# Altium schematic sheet LAN8870_PINOUT.SchDoc
size C; SheetNumber: 3; SheetTotal: 12
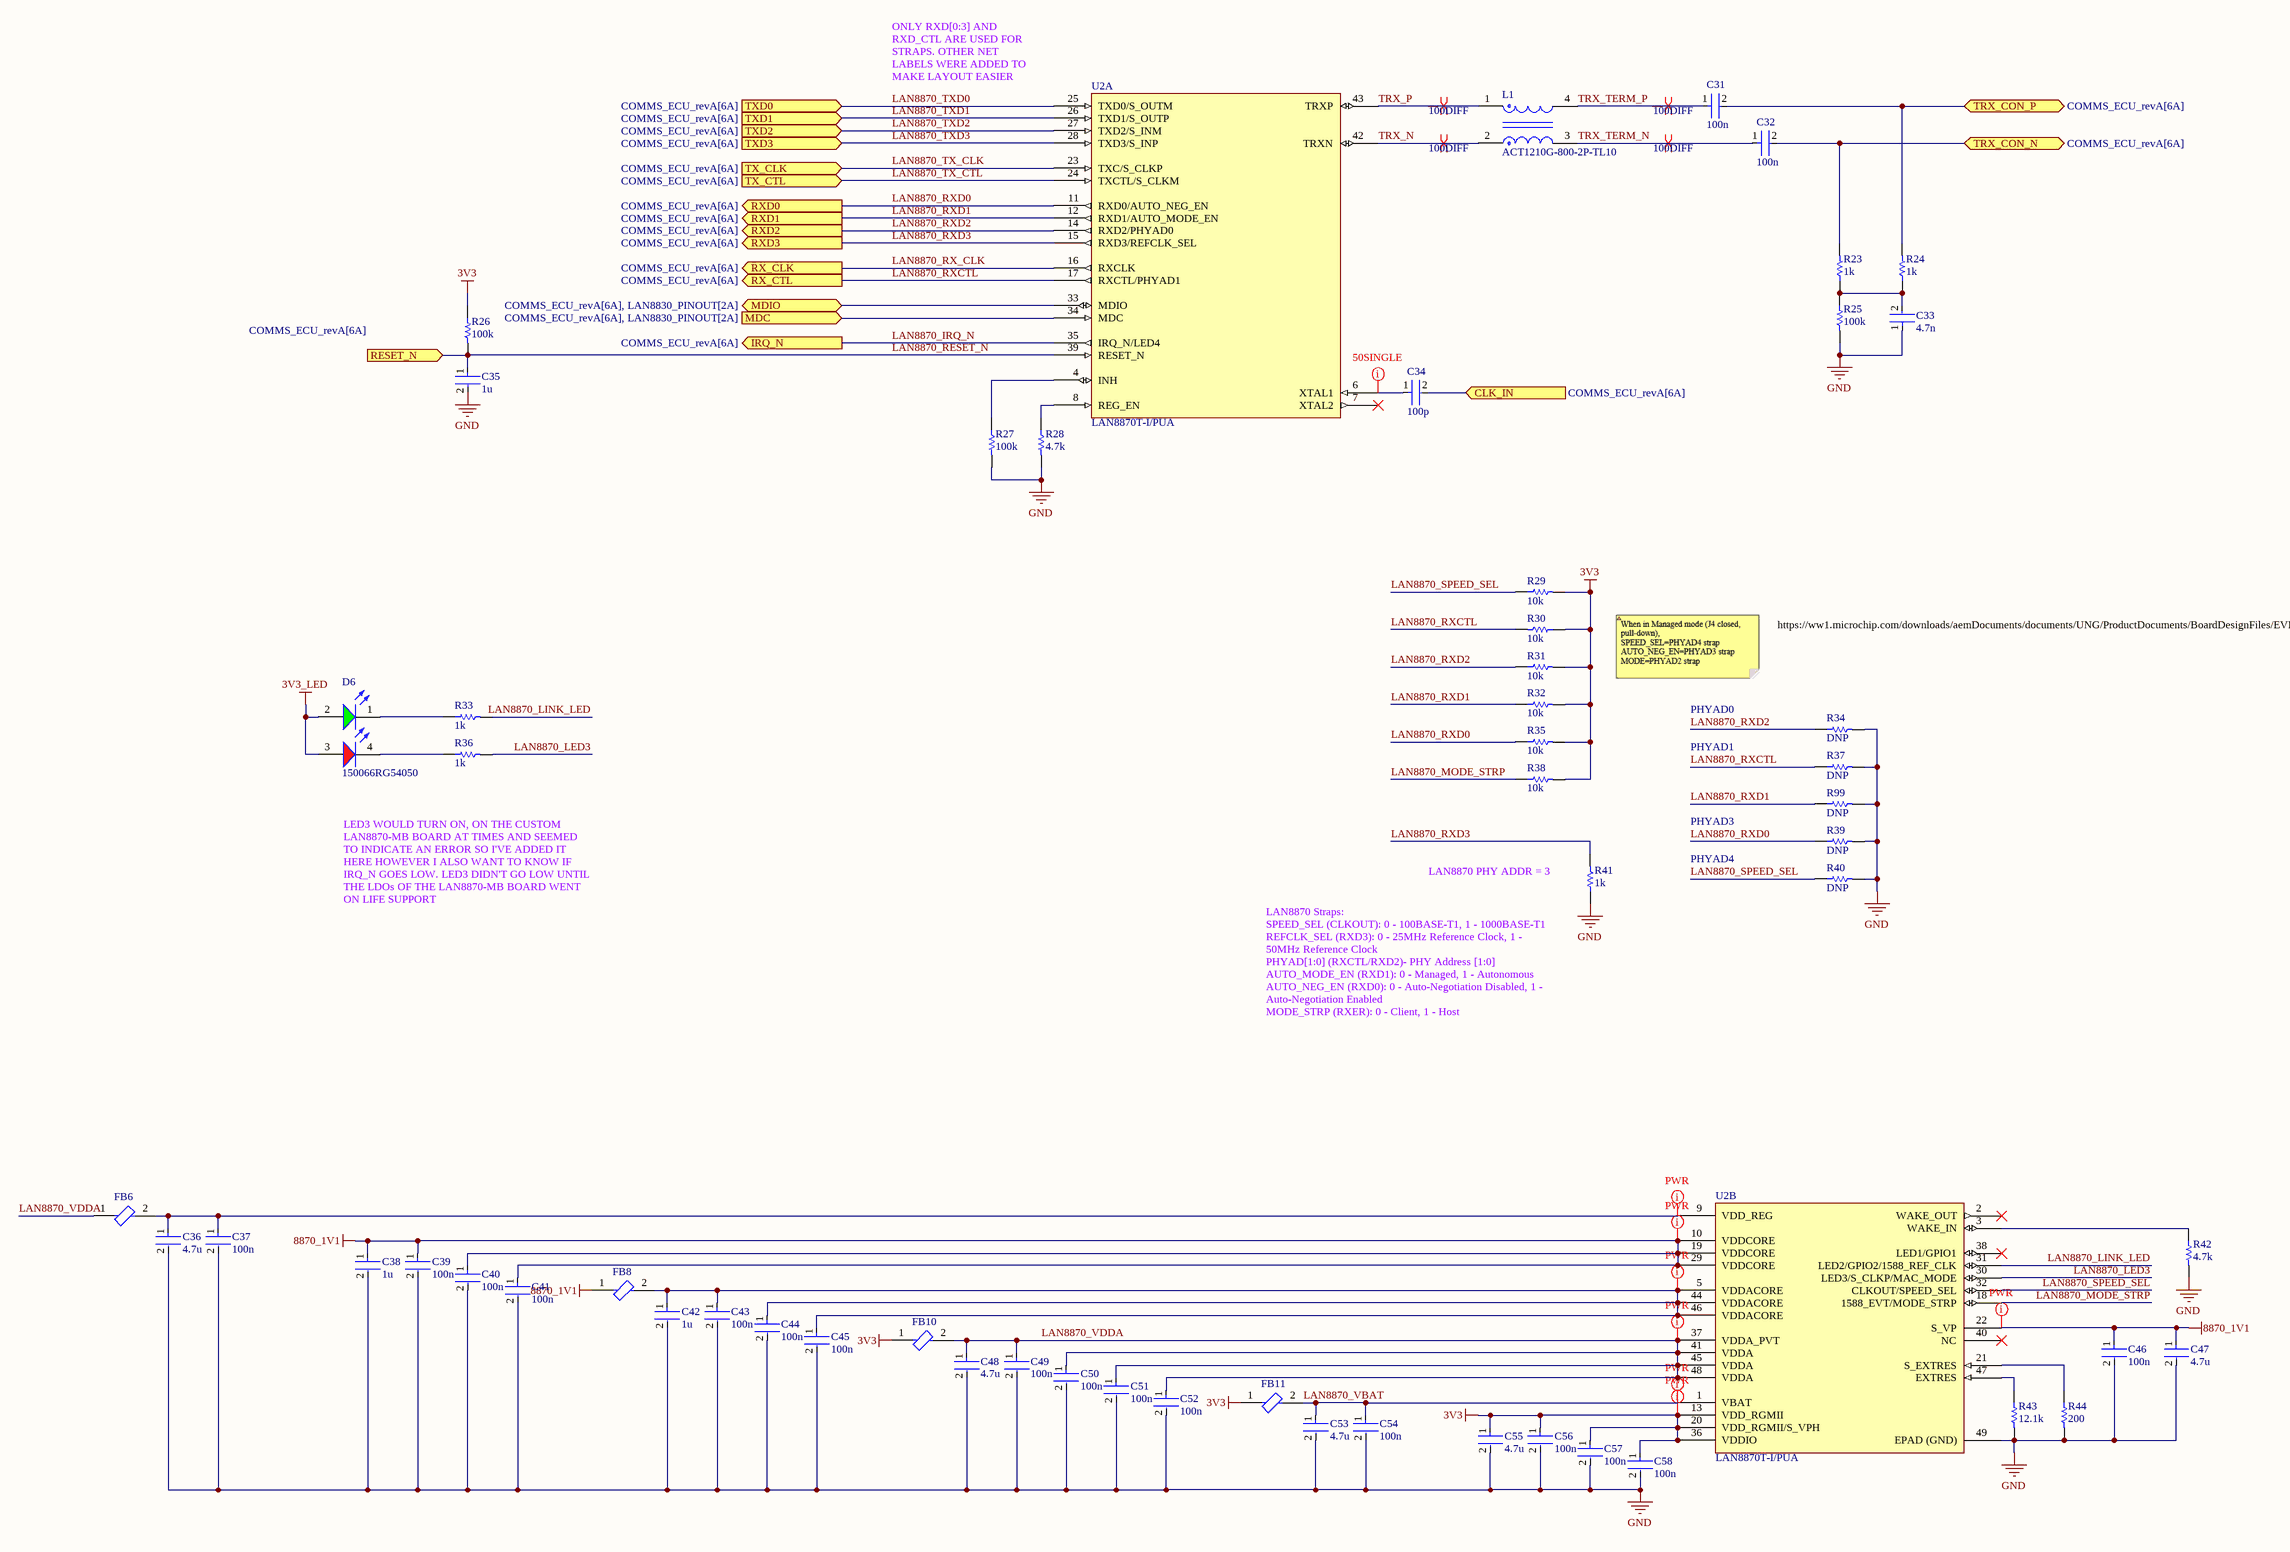
[diagram p0: LAN8870_PINOUT.SchDoc]

## Parts
C31  100n  [FP-0402-L_1_0_0_05-W_0_5-IPC_A]
C32  100n  [FP-0402-L_1_0_0_05-W_0_5-IPC_A]
C33  4.7n  [FP-0402-L_1_0_0_05-W_0_5-IPC_A]
C34  100p  [FP-0402-L_1_0_0_05-W_0_5-IPC_A]
C35  1u  [FP-0402-L_1_0_0_05-W_0_5-IPC_A]
C36  4.7u  [FP-0402-L_1_0_0_05-W_0_5-IPC_A]
C37  100n  [FP-0402-L_1_0_0_05-W_0_5-IPC_A]
C38  1u  [FP-0402-L_1_0_0_05-W_0_5-IPC_A]
C39  100n  [FP-0402-L_1_0_0_05-W_0_5-IPC_A]
C40  100n  [FP-0402-L_1_0_0_05-W_0_5-IPC_A]
C41  100n  [FP-0402-L_1_0_0_05-W_0_5-IPC_A]
C42  1u  [FP-0402-L_1_0_0_05-W_0_5-IPC_A]
C43  100n  [FP-0402-L_1_0_0_05-W_0_5-IPC_A]
C44  100n  [FP-0402-L_1_0_0_05-W_0_5-IPC_A]
C45  100n  [FP-0402-L_1_0_0_05-W_0_5-IPC_A]
C46  100n  [FP-0402-L_1_0_0_05-W_0_5-IPC_A]
C47  4.7u  [FP-0402-L_1_0_0_05-W_0_5-IPC_A]
C48  4.7u  [FP-0402-L_1_0_0_05-W_0_5-IPC_A]
C49  100n  [FP-0402-L_1_0_0_05-W_0_5-IPC_A]
C50  100n  [FP-0402-L_1_0_0_05-W_0_5-IPC_A]
C51  100n  [FP-0402-L_1_0_0_05-W_0_5-IPC_A]
C52  100n  [FP-0402-L_1_0_0_05-W_0_5-IPC_A]
C53  4.7u  [FP-0402-L_1_0_0_05-W_0_5-IPC_A]
C54  100n  [FP-0402-L_1_0_0_05-W_0_5-IPC_A]
C55  4.7u  [FP-0402-L_1_0_0_05-W_0_5-IPC_A]
C56  100n  [FP-0402-L_1_0_0_05-W_0_5-IPC_A]
C57  100n  [FP-0402-L_1_0_0_05-W_0_5-IPC_A]
C58  100n  [FP-0402-L_1_0_0_05-W_0_5-IPC_A]
D6  150066RG54050  [WL-SBCD_0606]
FB6  BLM18KG331SH1D  [FP-BLM18-0_15-t0_8-IPC_B]  (value not drawn)
FB8  BLM18KG331SH1D  [FP-BLM18-0_15-t0_8-IPC_B]  (value not drawn)
FB10  BLM18KG331SH1D  [FP-BLM18-0_15-t0_8-IPC_B]  (value not drawn)
FB11  BLM18KG331SH1D  [FP-BLM18-0_15-t0_8-IPC_B]  (value not drawn)
L1  ACT1210G-800-2P-TL10  [FP-ACT1210G-800-2P-TL10-MFG]
R23  1k  [R0603B]
R24  1k  [R0603B]
R25  100k  [R0603B]
R26  100k  [R0603B]
R27  100k  [R0603B]
R28  4.7k  [R0603B]
R29  10k  [R0603B]
R30  10k  [R0603B]
R31  10k  [R0603B]
R32  10k  [R0603B]
R33  1k  [R0603B]
R34  DNP  [R0603B]
R35  10k  [R0603B]
R36  1k  [R0603B]
R37  DNP  [R0603B]
R38  10k  [R0603B]
R39  DNP  [R0603B]
R40  DNP  [R0603B]
R41  1k  [R0603B]
R42  4.7k  [R0603B]
R43  12.1k  [R0603B]
R44  200  [R0603B]
R99  DNP  [R0603B]
U2  LAN8870T-I/PUA  [QFN50P700X700X100_HS-49N]  (parts A,B of 2)

## Ports
CLK_IN (in, see COMMS_ECU_revA[6A]), IRQ_N (out, see COMMS_ECU_revA[6A]), MDC (in, see COMMS_ECU_revA[6A], LAN8830_PINOUT[2A]), MDIO (bidir, see COMMS_ECU_revA[6A], LAN8830_PINOUT[2A]), RESET_N (in, see COMMS_ECU_revA[6A]), RX_CLK (out, see COMMS_ECU_revA[6A]), RX_CTL (out, see COMMS_ECU_revA[6A]), RXD0 (out, see COMMS_ECU_revA[6A]), RXD1 (out, see COMMS_ECU_revA[6A]), RXD2 (out, see COMMS_ECU_revA[6A]), RXD3 (out, see COMMS_ECU_revA[6A]), TRX_CON_N (bidir, see COMMS_ECU_revA[6A]), TRX_CON_P (bidir, see COMMS_ECU_revA[6A]), TX_CLK (in, see COMMS_ECU_revA[6A]), TX_CTL (in, see COMMS_ECU_revA[6A]), TXD0 (in, see COMMS_ECU_revA[6A]), TXD1 (in, see COMMS_ECU_revA[6A]), TXD2 (in, see COMMS_ECU_revA[6A]), TXD3 (in, see COMMS_ECU_revA[6A])

## Nets
3V3: C55.1 C56.1 C57.1 C58.1 FB10.1 FB11.1 R26.1 R29.2 R30.1 R31.2 R32.2 R35.2 R38.2 U2.13(VDD_RGMII) U2.20(VDD_RGMII/S_VPH) U2.36(VDDIO)
3V3_LED: D6.2(A) D6.3(A)
8870_1V1: C38.1 C39.1 C40.1 C41.1 C46.1 C47.1 FB8.1 U2.10(VDDCORE) U2.19(VDDCORE) U2.22(S_VP) U2.29(VDDCORE)
GND: C33.1 C35.2 C36.2 C37.2 C38.2 C39.2 C40.2 C41.2 C42.2 C43.2 C44.2 C45.2 C46.2 C47.2 C48.2 C49.2 C50.2 C51.2 C52.2 C53.2 C54.2 C55.2 C56.2 C57.2 C58.2 R25.2 R27.2 R28.2 R34.2 R37.2 R39.2 R40.2 R41.1 R42.2 R43.2 R44.2 R99.2 U2.49(EPAD_(GND))
CLK_IN: C34.2 ; port CLK_IN
LAN8870_IRQ_N: U2.35(IRQ_N/LED4) ; port IRQ_N
LAN8870_LED3: R36.2 U2.30(LED3/S_CLKP/MAC_MODE)
LAN8870_LINK_LED: R33.2 U2.31(LED2/GPIO2/1588_REF_CLK)
LAN8870_MODE_STRP: R38.1 U2.18(1588_EVT/MODE_STRP)
LAN8870_RESET_N: C35.1 R26.2 U2.39(RESET_N) ; port RESET_N
LAN8870_RX_CLK: U2.16(RXCLK) ; port RX_CLK
LAN8870_RXCTL: R30.2 R37.1 U2.17(RXCTL/PHYAD1) ; port RX_CTL
LAN8870_RXD0: R35.1 R39.1 U2.11(RXD0/AUTO_NEG_EN) ; port RXD0
LAN8870_RXD1: R32.1 R99.1 U2.12(RXD1/AUTO_MODE_EN) ; port RXD1
LAN8870_RXD2: R31.1 R34.1 U2.14(RXD2/PHYAD0) ; port RXD2
LAN8870_RXD3: R41.2 U2.15(RXD3/REFCLK_SEL) ; port RXD3
LAN8870_SPEED_SEL: R29.1 R40.1 U2.32(CLKOUT/SPEED_SEL)
LAN8870_TX_CLK: U2.23(TXC/S_CLKP) ; port TX_CLK
LAN8870_TX_CTL: U2.24(TXCTL/S_CLKM) ; port TX_CTL
LAN8870_TXD0: U2.25(TXD0/S_OUTM) ; port TXD0
LAN8870_TXD1: U2.26(TXD1/S_OUTP) ; port TXD1
LAN8870_TXD2: U2.27(TXD2/S_INM) ; port TXD2
LAN8870_TXD3: U2.28(TXD3/S_INP) ; port TXD3
LAN8870_VBAT: C53.1 C54.1 FB11.2 U2.1(VBAT)
LAN8870_VDDA: C48.1 C49.1 C50.1 C51.1 C52.1 FB6.1 FB10.2 U2.37(VDDA_PVT) U2.41(VDDA) U2.45(VDDA) U2.48(VDDA)
MDC: U2.34(MDC) ; port MDC
MDIO: U2.33(MDIO) ; port MDIO
TRX_CON_N: C32.2 R23.2 ; port TRX_CON_N
TRX_CON_P: C31.2 R24.2 ; port TRX_CON_P
TRX_N: L1.2 U2.42(TRXN)
TRX_P: L1.1 U2.43(TRXP)
TRX_TERM_N: C32.1 L1.3
TRX_TERM_P: C31.1 L1.4
NetC33_2: C33.2 R23.1 R24.1 R25.1
NetC34_1: C34.1 U2.6(XTAL1)
NetC36_1: C36.1 C37.1 FB6.2 U2.9(VDD_REG)
NetC42_1: C42.1 C43.1 C44.1 C45.1 FB8.2 U2.5(VDDACORE) U2.44(VDDACORE) U2.46(VDDACORE)
NetD6_1: D6.1(K) R33.1
NetD6_4: D6.4(K) R36.1
NetR27_1: R27.1 U2.4(INH)
NetR28_1: R28.1 U2.8(REG_EN)
NetR42_1: R42.1 U2.3(WAKE_IN)
NetR43_1: R43.1 U2.47(EXTRES)
NetR44_1: R44.1 U2.21(S_EXTRES)

Not connected (* = marked no-connect by the designer): U2 2(WAKE_OUT)* 7(XTAL2)* 38(LED1/GPIO1)* 40(NC)*

## Layout directives
differential pair; differential pair class 100DIFF: TRX_N, TRX_P, TRX_TERM_N, TRX_TERM_P
net class PWR: 3V3, 8870_1V1, LAN8870_VBAT, LAN8870_VDDA, NetC36_1, NetC42_1
net class 50SINGLE: NetC34_1

## Notes on the sheet
- ONLY RXD[0:3] AND RXD_CTL ARE USED FOR STRAPS. OTHER NET LABELS WERE ADDED TO MAKE LAYOUT EASIER
- https://ww1.microchip.com/downloads/aemDocuments/documents/UNG/ProductDocuments/BoardDesignFiles/EVB-LAN8870-RGMII-Schematic.PDF
- PHYAD0
- PHYAD1
- LAN8870 PHY ADDR = 3
- PHYAD3
- PHYAD4
- LED3 WOULD TURN ON, ON THE CUSTOM LAN8870-MB BOARD AT TIMES AND SEEMED TO INDICATE AN ERROR SO I'VE ADDED IT HERE HOWEVER I ALSO WANT TO KNOW IF IRQ_N GOES LOW. LED3 DIDN'T GO LOW UNTIL THE LDOs OF THE LAN8870-MB BOARD WENT ON LIFE SUPPORT
- (near R41) LAN8870 Straps:
  SPEED_SEL (CLKOUT): 0 - 100BASE-T1, 1 - 1000BASE-T1
  REFCLK_SEL (RXD3): 0 - 25MHz Reference Clock, 1 - 50MHz Reference Clock
  PHYAD[1:0] (RXCTL/RXD2)- PHY Address [1:0]
  AUTO_MODE_EN (RXD1): 0 - Managed, 1 - Autonomous
  AUTO_NEG_EN (RXD0): 0 - Auto-Negotiation Disabled, 1 - Auto-Negotiation Enabled
  MODE_STRP (RXER): 0 - Client, 1 - Host

## Library data of the parts
C31-C58 = CMP-001-00058-1: LARGE PADS, 0402 CAP, CHANGE COMMENT TO MATCH REAL P/N; Capacitor Type: Ceramic; Min Operating Temperature: -55°C; Mounting Technology: Surface Mount; Pins: 2; Case/Package: 0402; RoHS Compliant: Yes; Max Operating Temperature: 85°C
D6 = CMP-004-00040-2: Led, Red/Grn, 180Mcd/230Mcd, 624Nm/525Nm Rohs Compliant: Yes; Source: rgled.SchLib; Component Type: Standard; Design Item ID: CMP-004-00034-2; Pins: 4
FB6 FB8 FB10 FB11 = CMP-06046-002069-1: Chip Ferrite Bead, 0603, 330Ω @ 100MHz, 0.08Ω, 25%, 1.7A; Number of Lines: 1; DC Resistance (DCR): 80mR; Packaging: Tape and Reel; Case/Package: 0603; Height: 0.037inch; Case Code (Metric): 1608; Length: 0.063inch; Package Quantity: 4000; Max Operating Temperature: 125°C; Case Code (Imperial): 0603; RoHS Compliant: Yes; Width: 0.032inch; Mount: Surface Mount; Min Operating Temperature: -55°C; Ratings: AEC-Q200; Max Current Rating: 1.7A
L1 = CMP-08256-000023-1: CMC 80UH 70MA 2LN 3.8KOHM SMD
R23 R24 R28-R33 R35 R36 R38 R41-R44 = CMP-009-00002-14: Resistor; Value: 100k
R25-R27 R34 R37 R39 R40 R99 = CMP-009-00002-14: Resistor
  R25-R27: Value: 100k
  R34 R37 R39 R40 R99: Value: DNP
U2 = CMP-015-00023-5: 100/1000BASE-T1 Rgmii/sgmii Phy; Case/Package: VQFN; Pins: 48